# Altium schematic sheet GPS.SchDoc
size A4
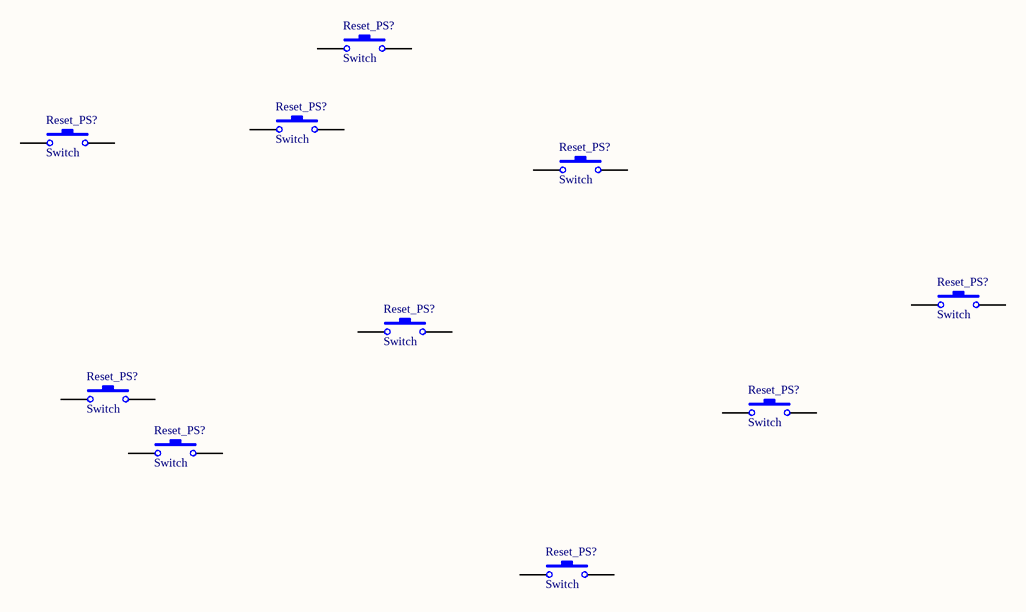
[diagram p0: GPS.SchDoc]

## Parts
(Parts that share a designator on the sheet are numbered #1, #2 ... from top to bottom, then left to right.)
Reset_PS?#1  Switch  [B3FS]
Reset_PS?#2  Switch  [B3FS]
Reset_PS?#3  Switch  [B3FS]
Reset_PS?#4  Switch  [B3FS]
Reset_PS?#5  Switch  [B3FS]
Reset_PS?#6  Switch  [B3FS]
Reset_PS?#7  Switch  [B3FS]
Reset_PS?#8  Switch  [B3FS]
Reset_PS?#9  Switch  [B3FS]
Reset_PS?#10  Switch  [B3FS]

## Nets

Not connected (* = marked no-connect by the designer): Reset_PS?#1 1 2; Reset_PS?#2 1 2; Reset_PS?#3 1 2; Reset_PS?#4 1 2; Reset_PS?#5 1 2; Reset_PS?#6 1 2; Reset_PS?#7 1 2; Reset_PS?#8 1 2; Reset_PS?#9 1 2; Reset_PS?#10 1 2

## Library data of the parts
Reset_PS?#1-Reset_PS?#10 = CMP-00077-A.5: SW B3FS-1002; Manufacturer: Omron; RS: 6866821; Manufacturer ID: B3FS-1002; Farnell: 3121173; DigiKey: SW1236-ND; Mouser: 653-B3FS-1002; Type: SMD